# EAGLE schematic 4x4x4_led_cube (EAGLE 5.11)

## Sheet 1 of 3
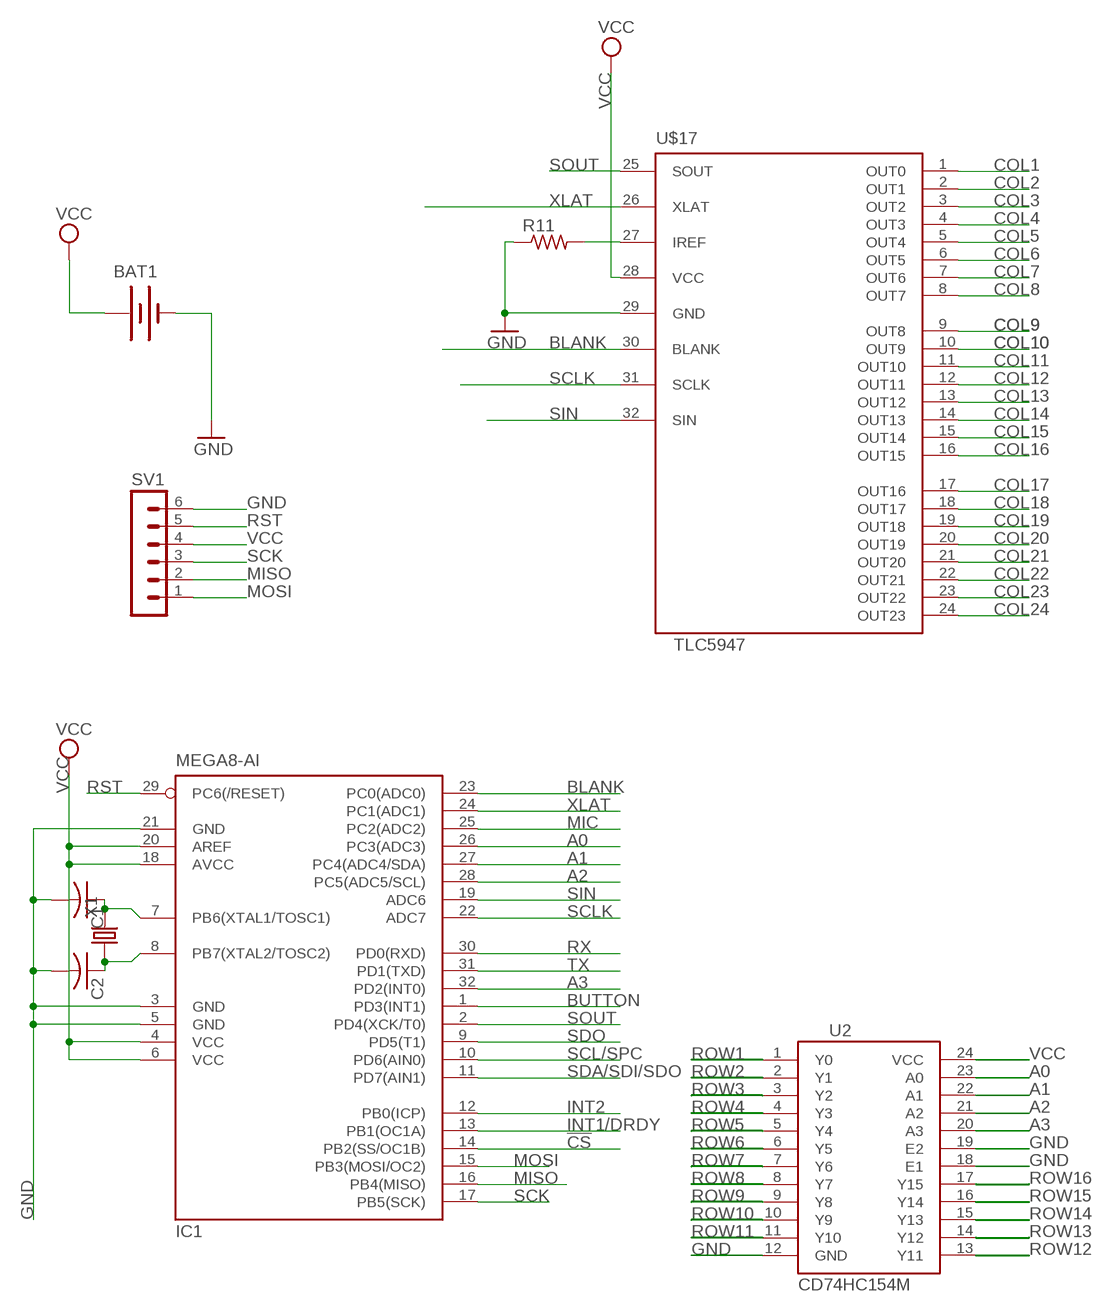
[diagram p0: schematic, sheet 1]

### Parts
BAT1  BATTERY20SMD  [BATTCON_20MM]
C1  C-USC0805  [C0805]
C2  C-USC0805  [C0805]
IC1  MEGA8-AI  [TQFP32-08]
R11  R-US_R1206  [R1206]
SV1  MA06-1  [MA06-1]
U2  CD74HC154M  [SO-24DW]
U$17  TLC5947  [QFN32]
X1  CRYSTAL-5032  [5032]

### Nets
!CS: IC1.14(PB2(SS/OC1B))
A0: IC1.26(PC3(ADC3)) U2.23(A0)
A1: IC1.27(PC4(ADC4/SDA)) U2.22(A1)
A2: IC1.28(PC5(ADC5/SCL)) U2.21(A2)
A3: IC1.32(PD2(INT0)) U2.20(A3)
BLANK: IC1.23(PC0(ADC0)) U$17.30(BLANK)
BUTTON: IC1.1(PD3(INT1))
COL1: U$17.1(OUT0)
COL2: U$17.2(OUT1)
COL3: U$17.3(OUT2)
COL4: U$17.4(OUT3)
COL5: U$17.5(OUT4)
COL6: U$17.6(OUT5)
COL7: U$17.7(OUT6)
COL8: U$17.8(OUT7)
COL9: U$17.9(OUT8)
COL10: U$17.10(OUT9)
COL11: U$17.11(OUT10)
COL12: U$17.12(OUT11)
COL13: U$17.13(OUT12)
COL14: U$17.14(OUT13)
COL15: U$17.15(OUT14)
COL16: U$17.16(OUT15)
COL17: U$17.17(OUT16)
COL18: U$17.18(OUT17)
COL19: U$17.19(OUT18)
COL20: U$17.20(OUT19)
COL21: U$17.21(OUT20)
COL22: U$17.22(OUT21)
COL23: U$17.23(OUT22)
COL24: U$17.24(OUT23)
GND: BAT1.2(-) C1.2 C2.2 IC1.3(GND) IC1.5(GND) IC1.21(GND) R11.1 SV1.6 U2.12(GND) U2.18(E1) U2.19(E2) U$17.29(GND) ; also sheet 2
INT1/DRDY: IC1.13(PB1(OC1A))
INT2: IC1.12(PB0(ICP))
MIC: IC1.25(PC2(ADC2))
MISO: IC1.16(PB4(MISO)) SV1.2
MOSI: IC1.15(PB3(MOSI/OC2)) SV1.1
N$7: C1.1 IC1.7(PB6(XTAL1/TOSC1)) X1.2
N$8: C2.1 IC1.8(PB7(XTAL2/TOSC2)) X1.1
N$13: R11.2 U$17.27(IREF)
ROW1: U2.1(Y0) ; also sheet 3
ROW2: U2.2(Y1) ; also sheet 3
ROW3: U2.3(Y2) ; also sheet 3
ROW4: U2.4(Y3) ; also sheet 3
ROW5: U2.5(Y4)
ROW6: U2.6(Y5)
ROW7: U2.7(Y6)
ROW8: U2.8(Y7)
ROW9: U2.9(Y8)
ROW10: U2.10(Y9)
ROW11: U2.11(Y10)
ROW12: U2.13(Y11)
ROW13: U2.14(Y12)
ROW14: U2.15(Y13)
ROW15: U2.16(Y14)
ROW16: U2.17(Y15)
RST: IC1.29(PC6(/RESET)) SV1.5
RX: IC1.30(PD0(RXD)) ; also sheet 2
SCK: IC1.17(PB5(SCK)) SV1.3
SCL/SPC: IC1.10(PD6(AIN0))
SCLK: IC1.22(ADC7) U$17.31(SCLK)
SDA/SDI/SDO: IC1.11(PD7(AIN1))
SDO: IC1.9(PD5(T1))
SIN: IC1.19(ADC6) U$17.32(SIN)
SOUT: IC1.2(PD4(XCK/T0)) U$17.25(SOUT)
TX: IC1.31(PD1(TXD)) ; also sheet 2
VCC: BAT1.1(+) IC1.4(VCC) IC1.6(VCC) IC1.18(AVCC) IC1.20(AREF) SV1.4 U2.24(VCC) U$17.28(VCC) ; also sheet 2,3
XLAT: IC1.24(PC1(ADC1)) U$17.26(XLAT)

## Sheet 2 of 3
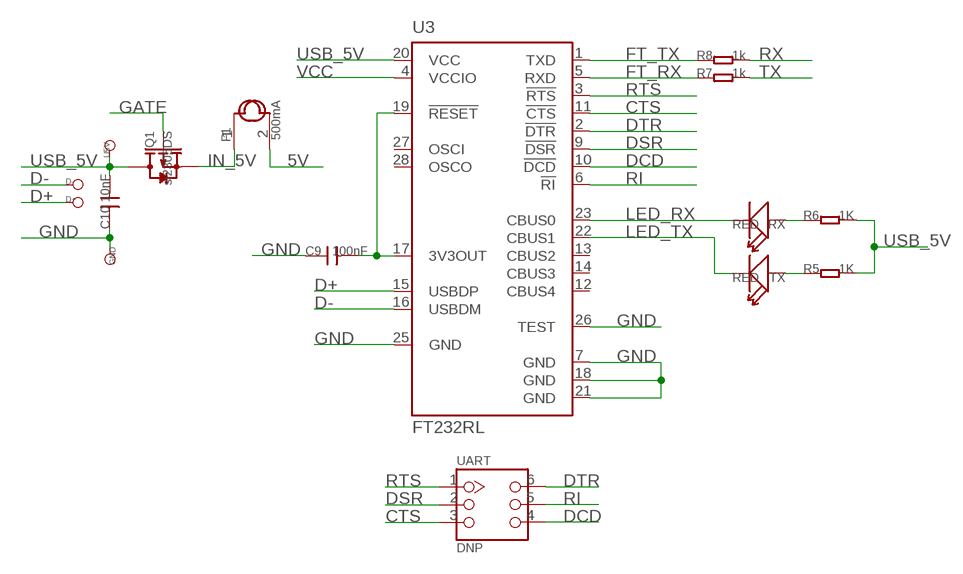
[diagram p1: schematic, sheet 2]

### Parts
C9  100nF  C-0402  [0402]
C10  10nF  C-0402  [0402]
D+  DNP  TEST_POINT_SIZE_3030  [TP_3535]
D-  DNP  TEST_POINT_SIZE_3030  [TP_3535]
F1  500mA  FUSE-1206  [1206]
GND  DNP  TEST_POINT_SIZE_3030  [TP_3535]
Q1  si2305DS  MOSFET-P-SOT23  [SOT23_]
R5  1K  R-0402  [0402]
R6  1K  R-0402  [0402]
R7  1k  R-0402  [0402]
R8  1k  R-0402  [0402]
RX  RED  LED-0603  [D0603]
TX  RED  LED-0603  [D0603]
U3  FT232RL  [SSOP28]
U5V  DNP  TEST_POINT_SIZE_3030  [TP_3535]
UART  DNP  HEADER-2X3P2.54  [CK_2X3]

### Nets
5V: F1.2
CTS: U3.11(!CTS) UART.3
D+: D+.T U3.15(USBDP)
D-: D-.T U3.16(USBDM)
DCD: U3.10(!DCD) UART.4
DSR: U3.9(!DSR) UART.2
DTR: U3.2(!DTR) UART.6
FT_RX: R7.1 U3.5(RXD)
FT_TX: R8.1 U3.1(TXD)
GATE: Q1.1(G)
GND: C9.1 C10.1 GND.T U3.7(GND) U3.18(GND) U3.21(GND) U3.25(GND) U3.26(TEST) ; also sheet 1
IN_5V: F1.1 Q1.2(S)
LED_RX: RX.- U3.23(CBUS0)
LED_TX: TX.- U3.22(CBUS1)
N$1: C9.2 U3.17(3V3OUT) U3.19(!RESET)
N$34: R5.1 TX.+
N$35: R6.1 RX.+
RI: U3.6(!RI) UART.5
RTS: U3.3(!RTS) UART.1
RX: R8.2 ; also sheet 1
TX: R7.2 ; also sheet 1
USB_5V: C10.2 Q1.3(D) R5.2 R6.2 U3.20(VCC) U5V.T
VCC: U3.4(VCCIO) ; also sheet 1,3
Unconnected: U3.12(CBUS4) U3.13(CBUS2) U3.14(CBUS3) U3.27(OSCI) U3.28(OSCO)

## Sheet 3 of 3
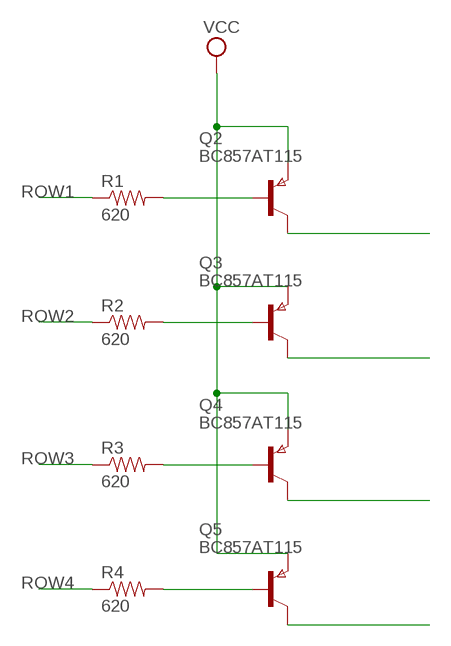
[diagram p2: schematic, sheet 3]

### Parts
Q2  BC857AT115  PNPSOT323SOT416  [SOT416]
Q3  BC857AT115  PNPSOT323SOT416  [SOT416]
Q4  BC857AT115  PNPSOT323SOT416  [SOT416]
Q5  BC857AT115  PNPSOT323SOT416  [SOT416]
R1  620  SPARKFUN_RESISTOR0603-RES  [SPARKFUN_0603-RES]
R2  620  SPARKFUN_RESISTOR0603-RES  [SPARKFUN_0603-RES]
R3  620  SPARKFUN_RESISTOR0603-RES  [SPARKFUN_0603-RES]
R4  620  SPARKFUN_RESISTOR0603-RES  [SPARKFUN_0603-RES]

### Nets
N$2: Q3.2(B) R2.2
N$3: Q2.2(B) R1.2
N$4: Q5.2(B) R4.2
N$5: Q4.2(B) R3.2
N$6: Q2.1(C)
N$9: Q3.1(C)
N$10: Q4.1(C)
N$11: Q5.1(C)
ROW1: R1.1 ; also sheet 1
ROW2: R2.1 ; also sheet 1
ROW3: R3.1 ; also sheet 1
ROW4: R4.1 ; also sheet 1
VCC: Q2.3(E) Q3.3(E) Q4.3(E) Q5.3(E) ; also sheet 1,2

## Library data of the parts
BAT1 = SparkFun:BATTERY: Battery Holders Various common sizes : AA, AAA, 20mm coin cell and 12mm coin cell.
C1 C2 = rcl:C-US: CAPACITOR, American symbol
C9 C10 = Discrete:C*: Ceramic Capacitors
D+ D- GND U5V = For_Test_Albert:TEST_POINT
F1 = Discrete:FUSE
IC1 = atmel:MEGA8: MICROCONTROLLER 8 Kbytes FLASH, 1 kbytes SRAM, 512 bytes EEPROM, USART, 6-channel 10 bit ADC, 2-channel 8 bit ADC Pin compatible with Atmega48, ATMega88, ATMega168 Source: avr.lbr; MPN: ATMEGA8-16AU; OC_FARNELL: 9171371; OC_NEWARK: 73M8863
Q1 = Discrete:MOSFET-P: Si2305DS Si2323CDS
Q2-Q5 = zetex:PNPSOT323: PNP TRANSISTOR
R1-R4 = Nullspace:SPARKFUN_RESISTOR: Resistor Basic schematic elements and footprints for 0603, 1206, and PTH 1/10th watt (small) resistors.
R5-R8 = Discrete:R*
R11 = rcl:R-US_: RESISTOR, American symbol
RX TX = Discrete:LED*
SV1 = NSL:MA06-1: PIN HEADER
U2 = SparkFun:CD74HC154M: High-Speed CMOS Logic 4- to 16-Line Decoder/Demultiplexer
U3 = ICs_v54:FT232R: Source: http://www.ftdichip.com/Documents/DataSheets/DS_FT232R_v104.pdf
U$17 = lil_rgb:TLC5947
UART = Connector:HEADER-2X3P
X1 = NSL_MiniQuad:CRYSTAL*: CRYSTAL

## Net classes
0 default: width 0.254 mm